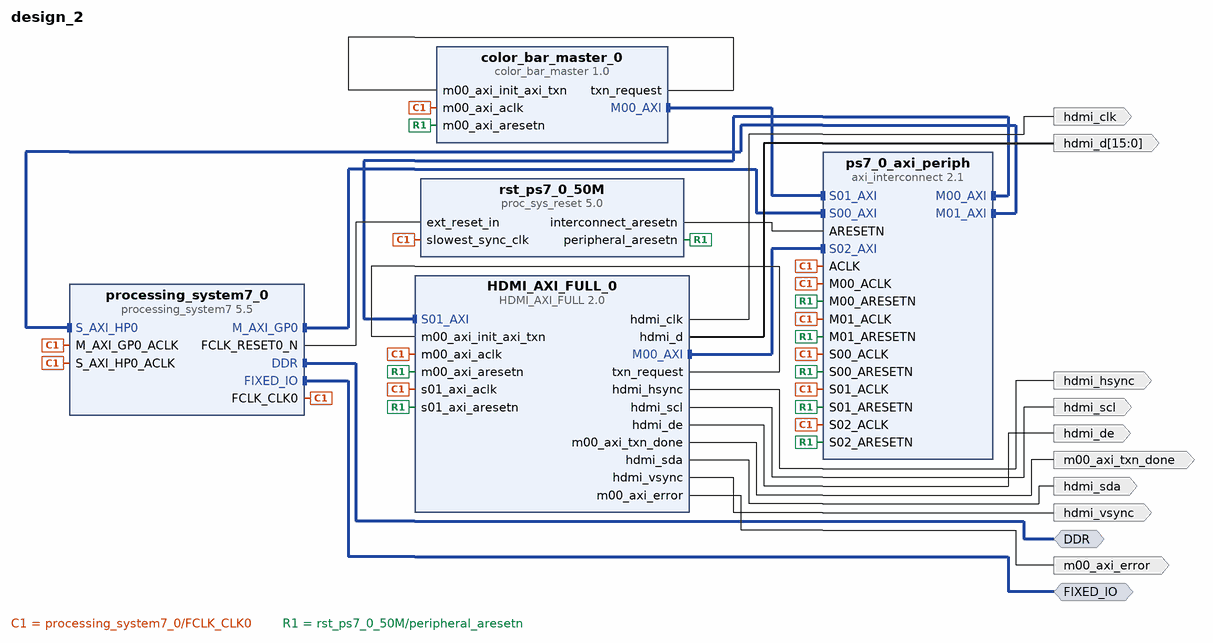
[diagram p0: block diagram of the top level]
# Vivado block design design_2, xc7z020clg484-1, Vivado 2018.2
create_bd_design design_2

create_bd_intf_port -mode Master -vlnv xilinx.com:interface:ddrx_rtl:1.0 DDR
create_bd_intf_port -mode Master -vlnv xilinx.com:display_processing_system7:fixedio_rtl:1.0 FIXED_IO
create_bd_port -dir O m00_axi_txn_done
create_bd_port -dir O -from 15 -to 0 hdmi_d
create_bd_port -dir O hdmi_clk
create_bd_port -dir O hdmi_scl
create_bd_port -dir O hdmi_hsync
create_bd_port -dir O hdmi_vsync
create_bd_port -dir O hdmi_sda
create_bd_port -dir O hdmi_de
create_bd_port -dir O m00_axi_error

create_bd_cell -type ip -vlnv xilinx.com:user:HDMI_AXI_FULL:2.0 HDMI_AXI_FULL_0
set_property -dict [list \
  CONFIG.C_M00_AXI_BURST_LEN 64 \
  CONFIG.C_M00_AXI_AWUSER_WIDTH 0 \
  CONFIG.C_M00_AXI_ARUSER_WIDTH 0 \
  CONFIG.C_M00_AXI_WUSER_WIDTH 0 \
  CONFIG.C_M00_AXI_RUSER_WIDTH 10 \
  CONFIG.C_M00_AXI_BUSER_WIDTH 0 \
] [get_bd_cells HDMI_AXI_FULL_0]
create_bd_cell -type ip -vlnv xilinx.com:ip:processing_system7:5.5 processing_system7_0
set_property -dict [list \
  CONFIG.PCW_UART_PERIPHERAL_FREQMHZ 100 \
  CONFIG.PCW_FPGA0_PERIPHERAL_FREQMHZ 150 \
  CONFIG.PCW_USE_S_AXI_HP0 1 \
  CONFIG.PCW_UIPARAM_DDR_PARTNO {MT41K128M16 HA-15E} \
  CONFIG.PCW_UART1_PERIPHERAL_ENABLE 1 \
  CONFIG.PCW_UART1_UART1_IO {MIO 48 .. 49} \
] [get_bd_cells processing_system7_0]
# 42 more settings of processing_system7_0 are not shown: defaults, MIO pin electricals, DDR timing, and values the tool derives
create_bd_cell -type ip -vlnv xilinx.com:ip:axi_interconnect:2.1 ps7_0_axi_periph
set_property -dict {CONFIG.NUM_SI 3 CONFIG.NUM_MI 2} [get_bd_cells ps7_0_axi_periph]
create_bd_cell -type ip -vlnv xilinx.com:ip:proc_sys_reset:5.0 rst_ps7_0_50M
create_bd_cell -type ip -vlnv xilinx.com:user:color_bar_master:1.0 color_bar_master_0
set_property -dict [list \
  CONFIG.C_M00_AXI_TARGET_SLAVE_BASE_ADDR 0x10000000 \
  CONFIG.C_M00_AXI_BURST_LEN 64 \
  CONFIG.C_M00_AXI_AWUSER_WIDTH 0 \
  CONFIG.C_M00_AXI_ARUSER_WIDTH 0 \
  CONFIG.C_M00_AXI_WUSER_WIDTH 0 \
  CONFIG.C_M00_AXI_RUSER_WIDTH 0 \
  CONFIG.C_M00_AXI_BUSER_WIDTH 0 \
] [get_bd_cells color_bar_master_0]

# ---- connections ----

connect_bd_intf_net [get_bd_intf_pins processing_system7_0/M_AXI_GP0] [get_bd_intf_pins ps7_0_axi_periph/S00_AXI]
connect_bd_intf_net [get_bd_intf_pins ps7_0_axi_periph/M00_AXI] [get_bd_intf_pins HDMI_AXI_FULL_0/S01_AXI]
connect_bd_intf_net [get_bd_intf_pins color_bar_master_0/M00_AXI] [get_bd_intf_pins ps7_0_axi_periph/S01_AXI]
connect_bd_intf_net [get_bd_intf_pins HDMI_AXI_FULL_0/M00_AXI] [get_bd_intf_pins ps7_0_axi_periph/S02_AXI]
connect_bd_intf_net [get_bd_intf_pins ps7_0_axi_periph/M01_AXI] [get_bd_intf_pins processing_system7_0/S_AXI_HP0]
connect_bd_intf_net [get_bd_intf_ports DDR] [get_bd_intf_pins processing_system7_0/DDR]
connect_bd_intf_net [get_bd_intf_ports FIXED_IO] [get_bd_intf_pins processing_system7_0/FIXED_IO]
connect_bd_net [get_bd_pins processing_system7_0/FCLK_CLK0] \
  [get_bd_pins processing_system7_0/M_AXI_GP0_ACLK] [get_bd_pins rst_ps7_0_50M/slowest_sync_clk] \
  [get_bd_pins HDMI_AXI_FULL_0/s01_axi_aclk] [get_bd_pins HDMI_AXI_FULL_0/m00_axi_aclk] \
  [get_bd_pins processing_system7_0/S_AXI_HP0_ACLK] [get_bd_pins ps7_0_axi_periph/S00_ACLK] \
  [get_bd_pins ps7_0_axi_periph/M00_ACLK] [get_bd_pins ps7_0_axi_periph/ACLK] [get_bd_pins ps7_0_axi_periph/S01_ACLK] \
  [get_bd_pins ps7_0_axi_periph/S02_ACLK] [get_bd_pins ps7_0_axi_periph/M01_ACLK] \
  [get_bd_pins color_bar_master_0/m00_axi_aclk]
connect_bd_net [get_bd_pins processing_system7_0/FCLK_RESET0_N] [get_bd_pins rst_ps7_0_50M/ext_reset_in]
connect_bd_net [get_bd_pins rst_ps7_0_50M/peripheral_aresetn] \
  [get_bd_pins HDMI_AXI_FULL_0/s01_axi_aresetn] [get_bd_pins HDMI_AXI_FULL_0/m00_axi_aresetn] \
  [get_bd_pins ps7_0_axi_periph/S00_ARESETN] [get_bd_pins ps7_0_axi_periph/M00_ARESETN] \
  [get_bd_pins ps7_0_axi_periph/S01_ARESETN] [get_bd_pins ps7_0_axi_periph/S02_ARESETN] \
  [get_bd_pins ps7_0_axi_periph/M01_ARESETN] [get_bd_pins color_bar_master_0/m00_axi_aresetn]
connect_bd_net [get_bd_pins rst_ps7_0_50M/interconnect_aresetn] [get_bd_pins ps7_0_axi_periph/ARESETN]
connect_bd_net [get_bd_pins color_bar_master_0/txn_request] [get_bd_pins color_bar_master_0/m00_axi_init_axi_txn]
connect_bd_net [get_bd_pins HDMI_AXI_FULL_0/txn_request] [get_bd_pins HDMI_AXI_FULL_0/m00_axi_init_axi_txn]
connect_bd_net [get_bd_pins HDMI_AXI_FULL_0/m00_axi_txn_done] [get_bd_ports m00_axi_txn_done]
connect_bd_net [get_bd_pins HDMI_AXI_FULL_0/hdmi_d] [get_bd_ports hdmi_d]
connect_bd_net [get_bd_pins HDMI_AXI_FULL_0/hdmi_clk] [get_bd_ports hdmi_clk]
connect_bd_net [get_bd_pins HDMI_AXI_FULL_0/hdmi_scl] [get_bd_ports hdmi_scl]
connect_bd_net [get_bd_pins HDMI_AXI_FULL_0/hdmi_hsync] [get_bd_ports hdmi_hsync]
connect_bd_net [get_bd_pins HDMI_AXI_FULL_0/hdmi_vsync] [get_bd_ports hdmi_vsync]
connect_bd_net [get_bd_pins HDMI_AXI_FULL_0/hdmi_sda] [get_bd_ports hdmi_sda]
connect_bd_net [get_bd_pins HDMI_AXI_FULL_0/hdmi_de] [get_bd_ports hdmi_de]
connect_bd_net [get_bd_pins HDMI_AXI_FULL_0/m00_axi_error] [get_bd_ports m00_axi_error]

# ---- address map ----
assign_bd_address -offset 0x43C00000 -range 64K -target_address_space [get_bd_addr_spaces color_bar_master_0/M00_AXI] [get_bd_addr_segs HDMI_AXI_FULL_0/S01_AXI/S01_AXI_reg]
assign_bd_address -offset 0x50000000 -range 256M -target_address_space [get_bd_addr_spaces color_bar_master_0/M00_AXI] [get_bd_addr_segs processing_system7_0/S_AXI_HP0/HP0_DDR_LOWOCM]
assign_bd_address -offset 0x50000000 -range 256M -target_address_space [get_bd_addr_spaces HDMI_AXI_FULL_0/M00_AXI] [get_bd_addr_segs processing_system7_0/S_AXI_HP0/HP0_DDR_LOWOCM]
assign_bd_address -offset 0x43C00000 -range 64K -target_address_space [get_bd_addr_spaces processing_system7_0/Data] [get_bd_addr_segs HDMI_AXI_FULL_0/S01_AXI/S01_AXI_reg]
assign_bd_address -offset 0x50000000 -range 256M -target_address_space [get_bd_addr_spaces processing_system7_0/Data] [get_bd_addr_segs processing_system7_0/S_AXI_HP0/HP0_DDR_LOWOCM]

validate_bd_design
save_bd_design
